# Altium schematic sheet 同向调偏放大器.SchDoc
size A4
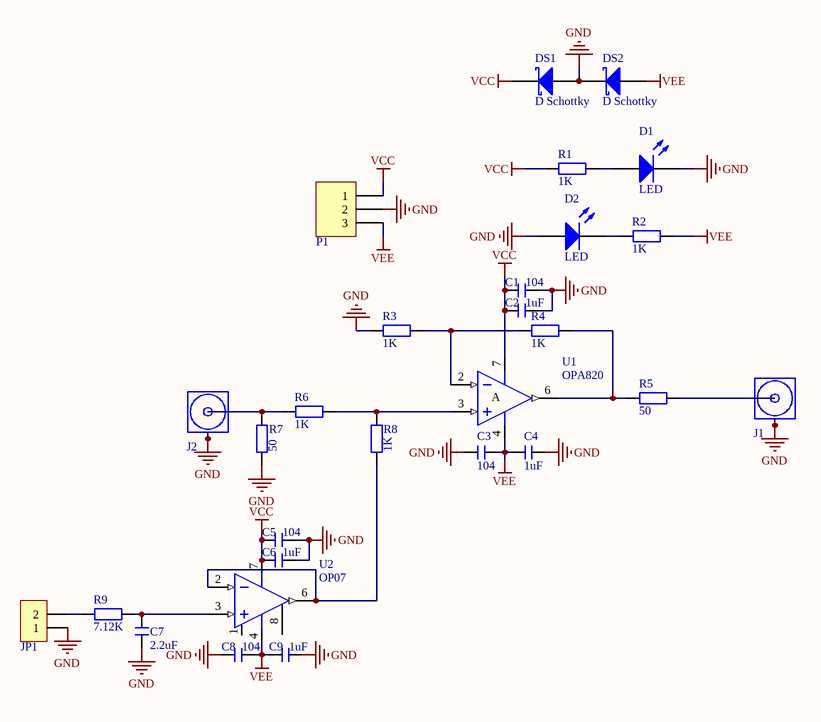
[diagram p0: 同向调偏放大器.SchDoc]

## Parts
C1  104  [C 0603]
C2  1uF  [C 0603]
C3  104  [C 0603]
C4  1uF  [C 0603]
C5  104  [C 0603]
C6  1uF  [C 0603]
C7  2.2uF  [C 0603]
C8  104  [C 0603]
C9  1uF  [C 0603]
D1  LED  [LED_0805]
D2  LED  [LED_0805]
DS1  D Schottky  [DIODE-SMA]
DS2  D Schottky  [DIODE-SMA]
J1  COAX  [MCX5.08-5-H]  (value not drawn)
J2  COAX  [MCX5.08-5-H]  (value not drawn)
JP1  HDR-1X2  [HDR-1X2]  (value not drawn)
P1  Header 3  [HDR3X1_B2]  (value not drawn)
R1  1K  [R 0805]
R2  1K  [R 0805]
R3  1K  [R 0603]
R4  1K  [R 0603]
R5  50  [R 0603]
R6  1K  [R 0603]
R7  50  [R 0603]
R8  1K  [R 0603]
R9  7.12K  [R 0603]
U1  OPA820  [SOIC8_N]
U2  OP07  [SO8_L]

## Nets
GND: C1.1 C2.1 C3.2 C4.1 C5.1 C6.1 C7.2 C8.2 C9.1 D1.2(K) D2.1(A) DS1.1 DS2.2 J1.2(GND) J1.3(GND) J1.4(GND) J1.5(GND) J2.2(GND) J2.3(GND) J2.4(GND) J2.5(GND) JP1.1 P1.2 R3.1 R7.1
VCC: C1.2 C2.2 C5.2 C6.2 DS1.2 P1.1 R1.1 U1.7(V+) U2.7(V+)
VEE: C3.1 C4.2 C8.1 C9.2 DS2.1 P1.3 R2.2 U1.4(V-) U2.4(V-)
NetC7_1: C7.1 R9.1 U2.3(IN+)
NetD1_1: D1.1(A) R1.2
NetD2_2: D2.2(K) R2.1
NetJ1_1: J1.1(Signal) R5.2
NetJ2_1: J2.1(Signal) R6.2 R7.2
NetJP1_2: JP1.2 R9.2
NetR3_2: R3.2 R4.1 U1.2(-IN)
NetR4_2: R4.2 R5.1 U1.6(OUT)
NetR6_1: R6.1 R8.2 U1.3(+IN)
NetR8_1: R8.1 U2.2(IN-) U2.6(OUT)

Not connected (* = marked no-connect by the designer): U2 1(OFFSET_N1) 8(OFFSET_N2)

## Notes on the sheet
- (in symbol OPA820) A

## Library data of the parts
C1-C9 = C: 无极性贴片电容; 版权归属: 源创客; BOM名称: 无极性贴片电容; 学习资源: www.ooocke.com
D1 D2 = LED: 发光二极管; Published: 8-Jun-2000; LatestRevisionDate: 08-Jul-2005; LatestRevisionNote: Mech Layer 1 removed.; PackageReference: LED; Publisher: Altium Limited
DS1 DS2 = D Schottky: Schottky Diode; Published: 8-Jun-2000; LatestRevisionDate: 17-Jul-2002; LatestRevisionNote: Re-released for DXP Platform.; PackageReference: SMB; Publisher: Altium Limited; PackageDescription: DO-214-AA/SMB; 2 C-Bend Leads; Body 5.3 x 3.6 mm, inc. leads (LxW); Code_JEDEC: DO-214-AA
JP1 = Header 2: 2P接插件; 版权归属: 源创客; BOM名称: 2P接插件; 学习资源: www.ooocke.com
P1 = Header 3: 接插件; LatestRevisionDate: 17-Jul-2002; LatestRevisionNote: Re-released for DXP Platform.; Publisher: Altium Limited
R1-R9 = R: 贴片电阻; 版权归属: 源创客; BOM名称: 贴片电阻; 学习资源: www.ooocke.com
U1 = OPA820: 单位增益稳定低噪声电压反馈运算放大器
U2 = OP07: Precision Operational Amplifiers